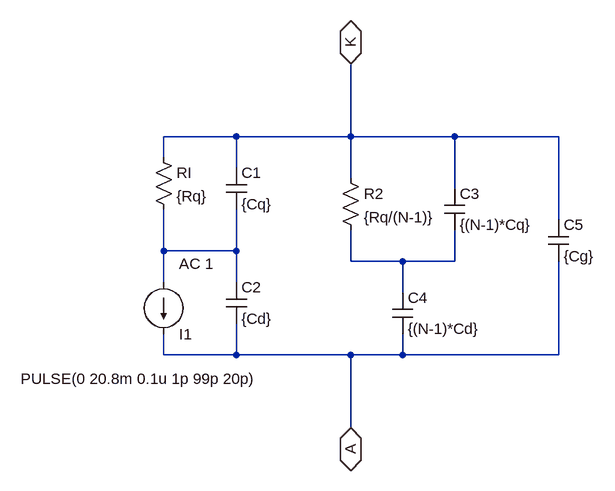
[diagram p0: schematic sipm_equivalente_controllo_tensione_pulse.asc]
sipm_equivalente_controllo_tensione_pulse.asc, the LTspice schematic file:
Version 4.1
SHEET 1 3028 692
WIRE 80 16 -32 16
WIRE 256 16 256 -96
WIRE 256 16 80 16
WIRE 416 16 256 16
WIRE 576 16 416 16
WIRE -32 48 -32 16
WIRE 80 64 80 16
WIRE 256 80 256 16
WIRE 416 96 416 16
WIRE 576 144 576 16
WIRE -32 192 -32 128
WIRE 80 192 80 128
WIRE 80 192 -32 192
WIRE 256 208 256 160
WIRE 336 208 256 208
WIRE 416 208 416 160
WIRE 416 208 336 208
WIRE -32 240 -32 192
WIRE 80 240 80 192
WIRE 336 256 336 208
WIRE -32 352 -32 320
WIRE 80 352 80 304
WIRE 80 352 -32 352
WIRE 256 352 80 352
WIRE 336 352 336 320
WIRE 336 352 256 352
WIRE 576 352 576 208
WIRE 576 352 336 352
WIRE 256 464 256 352
FLAG 256 464 A
IOPIN 256 464 BiDir
FLAG 256 -96 K
IOPIN 256 -96 BiDir
SYMBOL res -48 32 R0
SYMATTR InstName RI
SYMATTR Value {Rq}
SYMBOL res 240 64 R0
SYMATTR InstName R2
SYMATTR Value {Rq/(N-1)}
SYMBOL cap 64 64 R0
SYMATTR InstName C1
SYMATTR Value {Cq}
SYMBOL cap 64 240 R0
SYMATTR InstName C2
SYMATTR Value {Cd}
SYMBOL cap 400 96 R0
SYMATTR InstName C3
SYMATTR Value {(N-1)*Cq}
SYMBOL cap 320 256 R0
SYMATTR InstName C4
SYMATTR Value {(N-1)*Cd}
SYMBOL cap 560 144 R0
SYMATTR InstName C5
SYMATTR Value {Cg}
SYMBOL current -32 240 R0
WINDOW 0 24 80 Left 2
WINDOW 3 -220 149 Left 2
WINDOW 123 24 -28 Left 2
WINDOW 39 0 0 Left 2
SYMATTR InstName I1
SYMATTR Value PULSE(0 20.8m 0.1u 1p 99p 20p)
SYMATTR Value2 AC 1

The netlist it stands for:
* sipm_equivalente_controllo_tensione_pulse.asc
RI K N001 {Rq}
R2 K N002 {Rq/(N-1)}
C1 K N001 {Cq}
C2 N001 A {Cd}
C3 K N002 {(N-1)*Cq}
C4 N002 A {(N-1)*Cd}
C5 K A {Cg}
I1 N001 A PULSE(0 20.8m 0.1u 1p 99p 20p) AC 1
.backanno
.end